# Altium schematic sheet Switch Line of One DC Pin.SchDoc
size A3
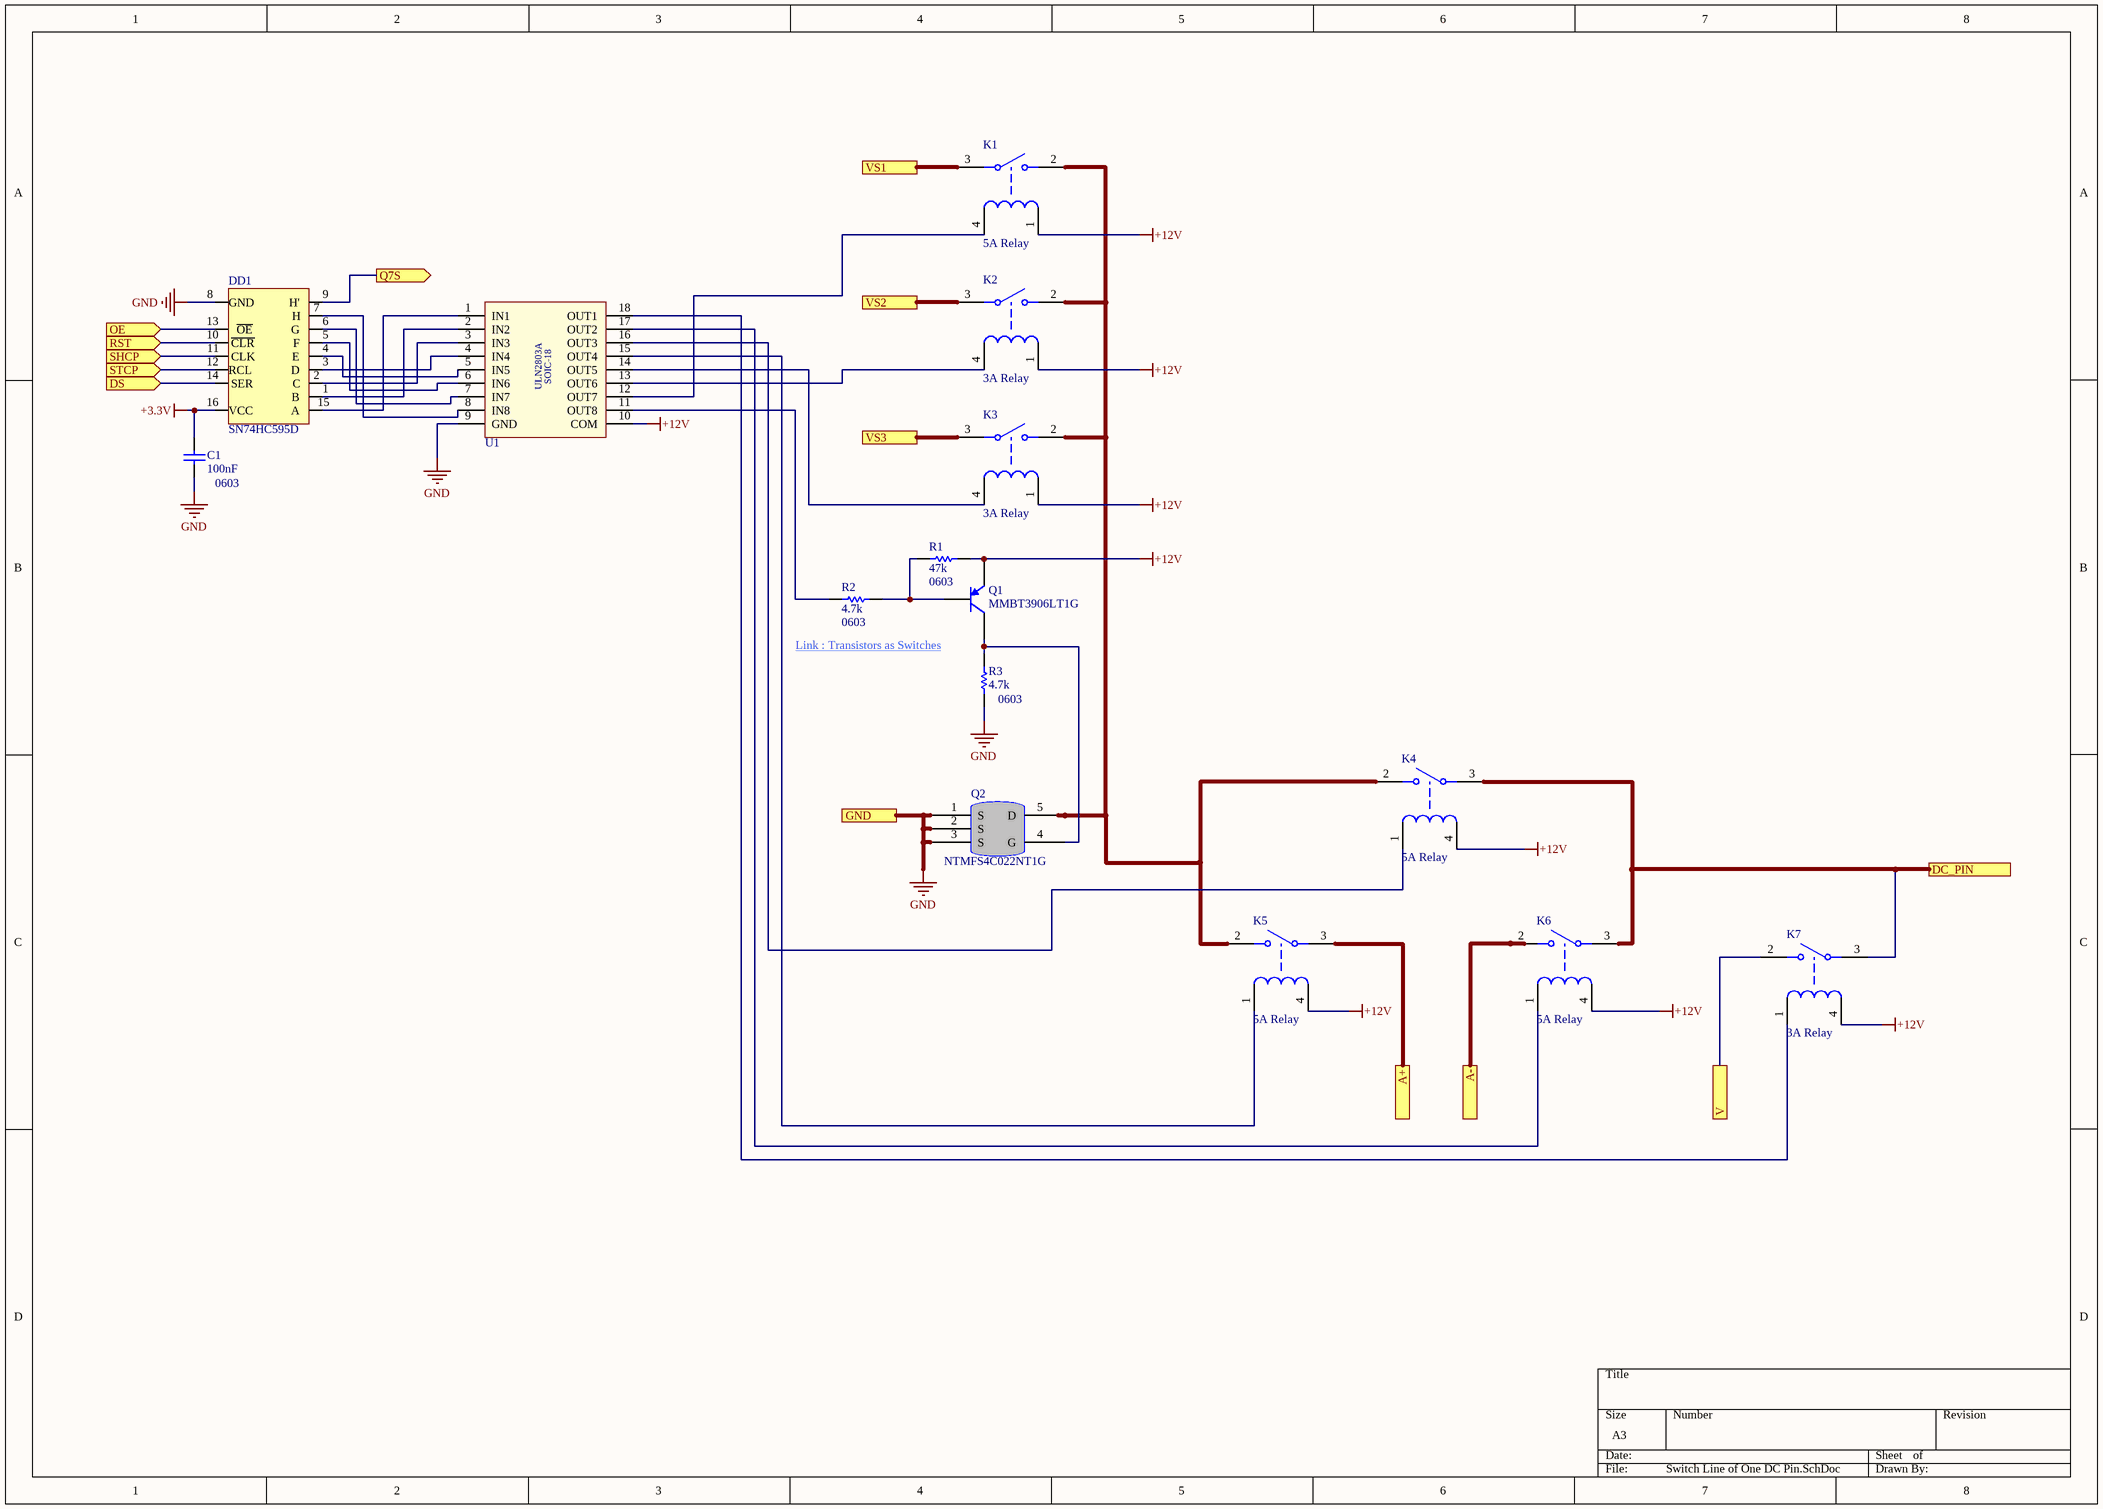
[diagram p0: Switch Line of One DC Pin.SchDoc]

## Parts
C1  100nF  Package / Case: 0603  [CAPC1608X09N]
DD1  SN74HC595D  [PCB-72k1vk0k27b6qyyenbg0-1]
K1  5A Relay  [PCB-ei6nokn2irsc2a7yt94x-1]
K2  3A Relay  [PCB-ei6nokn2irsc2a7yt94x-1]
K3  3A Relay  [PCB-ei6nokn2irsc2a7yt94x-1]
K4  5A Relay  [PCB-ei6nokn2irsc2a7yt94x-1]
K5  5A Relay  [PCB-ei6nokn2irsc2a7yt94x-1]
K6  5A Relay  [PCB-ei6nokn2irsc2a7yt94x-1]
K7  3A Relay  [PCB-ei6nokn2irsc2a7yt94x-1]
Q1  MMBT3906LT1G  [SOT-23]
Q2  NTMFS4C022NT1G  [PCB-iok221h7g3hg093tnixb-1]
R1  47k  Package / Case: 0603  [gen0603-2]
R2  4.7k  Package / Case: 0603  [gen0603-2]
R3  4.7k  Package / Case: 0603  [gen0603-2]
U1  ULN2803A (SOIC-18)  [PCB-gcdku7p92m9mz9ih2yin-1]  (value not drawn)

## Ports
A+, A-, DC_PIN, DS (in), GND, OE (in), Q7S (out), RST (in), SHCP (in), STCP (in), V, VS1, VS2, VS3

## Nets
+3.3V: C1.2 DD1.16(VCC)
+12V: K1.1 K2.1 K3.1 K4.4 K5.4 K6.4 K7.4 Q1.2(E) R1.1 U1.10(COM)
GND: C1.1 DD1.8(GND) Q2.1(S) Q2.2(S) Q2.3(S) R3.1 U1.9(GND) ; port GND
A+: K5.3 ; port A+
A-: K6.2 ; port A-
DC_PIN: K4.3 K6.3 K7.3 ; port DC_PIN
DS: DD1.14(SER) ; port DS
OE: DD1.13(~{OE}) ; port OE
Q7S: DD1.9(H') ; port Q7S
RST: DD1.10(~{CLR}) ; port RST
SHCP: DD1.11(CLK) ; port SHCP
STCP: DD1.12(RCL) ; port STCP
V: K7.2 ; port V
VS1: K1.3 ; port VS1
VS2: K2.3 ; port VS2
VS3: K3.3 ; port VS3
NetDD1_1: DD1.1(B) U1.2(IN2)
NetDD1_2: DD1.2(C) U1.3(IN3)
NetDD1_3: DD1.3(D) U1.4(IN4)
NetDD1_4: DD1.4(E) U1.5(IN5)
NetDD1_5: DD1.5(F) U1.6(IN6)
NetDD1_6: DD1.6(G) U1.7(IN7)
NetDD1_7: DD1.7(H) U1.8(IN8)
NetDD1_15: DD1.15(A) U1.1(IN1)
NetK1_2: K1.2 K2.2 K3.2 K4.2 K5.2 Q2.5(D)
NetK1_4: K1.4 U1.12(OUT7)
NetK2_4: K2.4 U1.13(OUT6)
NetK3_4: K3.4 U1.14(OUT5)
NetK4_1: K4.1 U1.16(OUT3)
NetK5_1: K5.1 U1.15(OUT4)
NetK6_1: K6.1 U1.17(OUT2)
NetK7_1: K7.1 U1.18(OUT1)
NetQ1_1: Q1.1(B) R1.2 R2.1
NetQ1_3: Q1.3(C) Q2.4(G) R3.2
NetR2_2: R2.2 U1.11(OUT8)

## Notes on the sheet
- (near R3) Link : Transistors as Switches <https://pe2bz.philpem.me.uk/Power/-%20Pulse/Info-UsingBipolarTransistors-as-Switches/transwit.htm>
- (in symbol CMP-19353911-22) SOIC-18

## Library data of the parts
C1 = CMP-2f55e5122ad9f092-5: 0603 10 nF 50 V ± 10% Tolerance X7R Surface Mount Multilayer Ceramic Capacitor; Manufacture Part Number: CC0603KRX7R9BB104; Manufacturer: YAGEO; Voltage-Rated: 50V; Capacitance Tolerance: 10%; Capacitance: 100nF; Supplier: LCSC; Supplier Part Number: C14663
DD1 = CMP-ded317d957220114-5: Shift Register Single 8-Bit Serial to Serial/Parallel 16-Pin SOIC Tube; Manufacture Part Number: 74HC595D,118; Manufacturer: Nexperia; Supplier: LCSC; Supplier Part Number: C5947; Package / Case: SOIC-16_150mil
K1 K4-K6 = CMP-edc624afa9603201-3: General Purpose Non Latching 12VDC SPST-NO 5A Through Hole Relays RoHS; Manufacturer: HF(Xiamen Hongfa Electroacoustic); Manufacture Part Number: HF46F/12-HS1; Supplier: LCSC; Supplier Part Number: C3636; Current-Rated: 5A
K2 K3 K7 = CMP-edc624afa9603201-3: Power Relay 12VDC 3DC/5AAC SPST-NO( (20.5mm 7.2mm 15.3mm)) THT; Manufacturer: Omron Electronics; Manufacture Part Number: G5NB-1A-E-DC12; Supplier: LCSC; Supplier Part Number: C225714; Current-Rated: 3A
Q1 = CMP-857798-9: Bipolar (BJT) Single Transistor, General Purpose, PNP, -40 V, 250 MHz, 225 mW, -200 mA, 300; Manufacturer: ON Semiconductor; Voltage Rating (DC): -40.0 V; Current Rating: -200 mA; Polarity: PNP; RoHS: Compliant; Mounting Style: Surface Mount; Lifecycle Status: Active; REACH SVHC Compliance: No SVHC; Supplier: LCSC; Supplier Part Number: C53444; OctopartID: 79f4b3b314a6a633; Breakdown Voltage [Collector to Emitter]: -40.0 V; Manufacture Part Number: MMBT3906LT1G; Package / Case: SOT-23
Q2 = CMP-42ac8f2778579d6b-1: Power MOSFET 30V 136A 1.7 mOhm Single N?Channel SO?8FL; Manufacturer: ON Semiconductor; Lead-Free Status: Lead Free; Octopart URL: https://octopart.com/ntmfs4c022nt1g-on+semiconductor-75571101; Lifecycle Status: Active; RoHS: Compliant; OctopartID: 42ac8f2778579d6b; Manufacture Part Number: NTMFS4C022NT1G; Supplier: LCSC; Supplier Part Number: C179623
R1 = CMP-1853278-27: Surface Mount Thick Film Resistor, RC Series, 1 kohm, 100 mW, - 1%, 50 V, 0603 [1608 Metric]; Manufacturer: UNI-ROYAL(Uniroyal Elec); Manufacture Part Number: 0603WAF4702T5E; Resistance Tolerance: 1%; Supplier: LCSC; Supplier Part Number: C25819; Resistance: 47k; Resistance Tolarance: *
R2 R3 = CMP-1853278-27: Surface Mount Thick Film Resistor, RC Series, 1 kohm, 100 mW, - 1%, 50 V, 0603 [1608 Metric]; Manufacturer: YAGEO; Manufacture Part Number: RC0603FR-074K7L; Resistance Tolerance: 1%; Supplier: LCSC; Supplier Part Number: C99782; Resistance: 4.7k
  R2: Resistance Tolarance: *
U1 = CMP-19353911-22: Bipolar (BJT) Array Transistor, Darlington, NPN, 50 V, 500 mA, SOIC; Manufacturer: Mixic; Manufacture Part Number: ULN2803A; Supplier: LCSC; Supplier Part Number: C107219; Package / Case: SOP-18_300mil